# Altium schematic sheet 12-Dash_Inputs.SchDoc
size A4
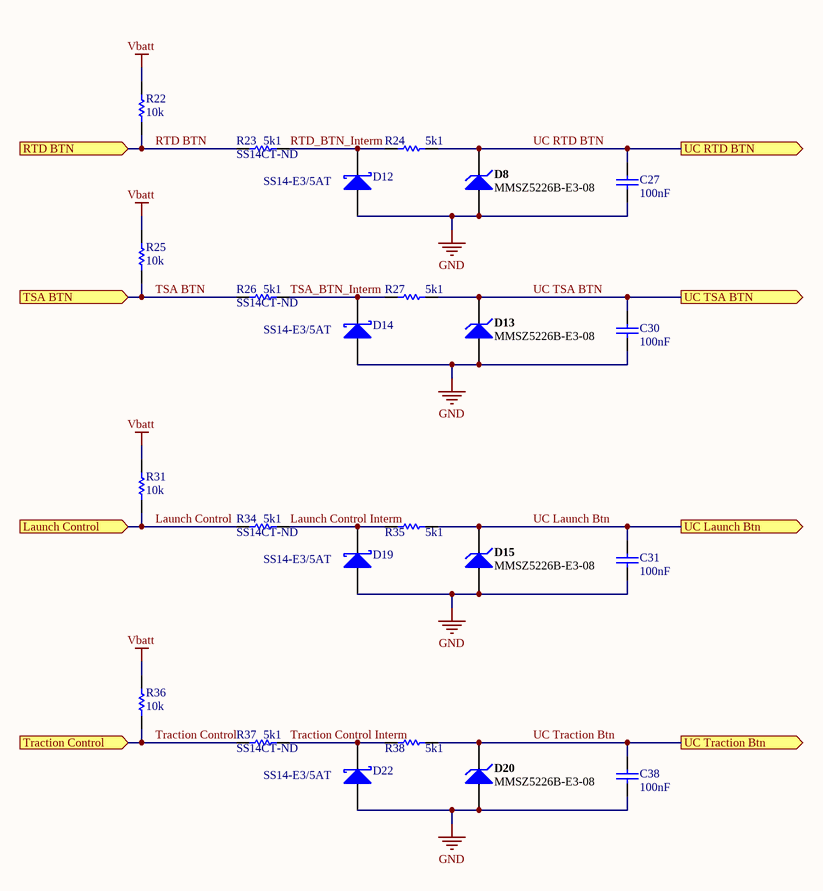
[diagram p0: 12-Dash_Inputs.SchDoc]

## Parts
C27  value 100nF  [1608[0603]]  (hidden comment: Cap)
C30  value 100nF  [1608[0603]]  (hidden comment: Cap)
C31  value 100nF  [1608[0603]]  (hidden comment: Cap)
C38  value 100nF  [1608[0603]]  (hidden comment: Cap)
D8  MMSZ5226B-E3-08  [VISH-SOD-123-2_V]
D12  SS14-E3/5AT  Supplier Part Number 1: SS14CT-ND  [VISH-DO-214AC-2_V]
D13  MMSZ5226B-E3-08  [VISH-SOD-123-2_V]
D14  SS14-E3/5AT  Supplier Part Number 1: SS14CT-ND  [VISH-DO-214AC-2_V]
D15  MMSZ5226B-E3-08  [VISH-SOD-123-2_V]
D19  SS14-E3/5AT  Supplier Part Number 1: SS14CT-ND  [VISH-DO-214AC-2_V]
D20  MMSZ5226B-E3-08  [VISH-SOD-123-2_V]
D22  SS14-E3/5AT  Supplier Part Number 1: SS14CT-ND  [VISH-DO-214AC-2_V]
R22  value 10k  [1608[0603]]  (hidden comment: Res1)
R23  value 5k1  [1608[0603]]  (hidden comment: Res1)
R24  value 5k1  [1608[0603]]  (hidden comment: Res1)
R25  value 10k  [1608[0603]]  (hidden comment: Res1)
R26  value 5k1  [1608[0603]]  (hidden comment: Res1)
R27  value 5k1  [1608[0603]]  (hidden comment: Res1)
R31  value 10k  [1608[0603]]  (hidden comment: Res1)
R34  value 5k1  [1608[0603]]  (hidden comment: Res1)
R35  value 5k1  [1608[0603]]  (hidden comment: Res1)
R36  value 10k  [1608[0603]]  (hidden comment: Res1)
R37  value 5k1  [1608[0603]]  (hidden comment: Res1)
R38  value 5k1  [1608[0603]]  (hidden comment: Res1)

## Ports
Launch Control (in), RTD BTN (in), Traction Control (in), TSA BTN (in), UC Launch Btn (out), UC RTD BTN (out), UC Traction Btn (out), UC TSA BTN (out)

## Nets
GND: C27.1 C30.1 C31.1 C38.1 D8.1(A) D12.1(A) D13.1(A) D14.1(A) D15.1(A) D19.1(A) D20.1(A) D22.1(A)
Vbatt: R22.2 R25.2 R31.2 R36.2
Launch Control: R31.1 R34.1 ; port Launch Control
Launch Control Interm: D19.2(K) R34.2 R35.1
RTD BTN: R22.1 R23.1 ; port RTD BTN
RTD_BTN_Interm: D12.2(K) R23.2 R24.1
Traction Control: R36.1 R37.1 ; port Traction Control
Traction Control Interm: D22.2(K) R37.2 R38.1
TSA BTN: R25.1 R26.1 ; port TSA BTN
TSA_BTN_Interm: D14.2(K) R26.2 R27.1
UC Launch Btn: C31.2 D15.2(K) R35.2 ; port UC Launch Btn
UC RTD BTN: C27.2 D8.2(K) R24.2 ; port UC RTD BTN
UC Traction Btn: C38.2 D20.2(K) R38.2 ; port UC Traction Btn
UC TSA BTN: C30.2 D13.2(K) R27.2 ; port UC TSA BTN

## Library data of the parts
C27 C30 C31 C38 = Cap: Capacitor; Manufacturer: Yageo; Manufacturer Part Number: CC0603KRX7R9BB104; Capacitance: 0.10µF; Tolerance: ±10%; Voltage - Rated: 50V; Temperature Coefficient: X7R; Supplier 1: Digi-Key; Supplier Part Number 1: 311-1344-1-ND; RoHS: RoHS Compliant; Category: Capacitors; Stock 1: 4016262; Pricing 1: 1=0.15, 10=0.043, 25=0.0312, 50=0.0232, 100=0.0189, 250=0.0158, 500=0.01346, 1000=0.01059 (CAD); Packaging: Cut Tape (CT); Part Status: Active; Operating Temperature: -55°C ~ 125°C; Features: -; Ratings: -; Applications: General Purpose; Failure Rate: -; Mounting Type: Surface Mount, MLCC; Package / Case: 0603 (1608 Metric); Size / Dimension: 0.063" L x 0.031" W (1.60mm x 0.80mm); Height - Seated (Max): -; Thickness (Max): 0.035" (0.90mm); Lead Spacing: -; Lead Style: -; ComponentLink1URL: http://www.yageo.com/documents/recent/UPY-GPHC_X7R_6.3V-to-50V_16.pdf; ComponentLink1Description: http://www.yageo.com/documents/recent/UPY-GPHC_X7R_6.3V-to-50V_16.pdf
D8 D13 D15 D20 = CMP-0931-00026-1: Small Signal Zener Diode, 3.3 V +/- 5%, -55 to 155 degC, 2-Pin SOD-123, RoHS, Tape and Reel; Manufacturer: Vishay Semiconductor; Manufacturer Part Number: MMSZ5226B-7-F; Tolerance: +/- 5%; Test Current (IZT1) (mA): 20; Power Dissipation (mW): 500; Int. Construction: Single; Zener Impedance (IZT1) (Max.) (Ohm): 28; Zener Voltage (NOM.) (V): 3.3; Voltage - Zener (Nom) (Vz): 3.3V; Power - Max: 500mW; Impedance (Max) (Zzt): 28 Ohm; Current - Reverse Leakage @ Vr: 25µA @ 1V; Voltage - Forward (Vf) (Max) @ If: 900mV @ 10mA; DatasheetVersion: Rev. 1.9; ComponentLink2Description: Datasheet; PackageReference: SOD-123-2; ComponentLink1URL: http://www.vishay.com/; ComponentLink1Description: Manufacturer URL; Mounting Technology: Surface Mount; ComponentLink3Description: Package Specification; ComponentLink3URL: http://www.vishay.com/docs/85774/mmsz5225.pdf; PartNumber: MMSZ5226B-E3-08; PackageDescription: 2-Pin SMD, Body 2.7 x 1.55 mm, Height 1.35 mm; Operating Temperature: -55 to 150 degC; Packing: Tape and Reel; PackageVersion: Rev. 1.9; ComponentLink2URL: http://www.vishay.com/docs/85774/mmsz5225.pdf; RoHS: TRUE; Supplier 1: Digi-Key; Supplier Part Number 1: MMSZ5226B-FDICT-ND; Category: Discrete Semiconductor Products; Stock 1: 45935; Pricing 1: 1=0.29, 10=0.263, 100=0.1426, 500=0.08778, 1000=0.05985 (CAD); Packaging: Cut Tape (CT); Part Status: Active; Mounting Type: Surface Mount; Package / Case: SOD-123; Supplier Device Package: SOD-123; ComponentLink4URL: http://www.diodes.com/_files/datasheets/ds18010.pdf; ComponentLink4Description: http://www.diodes.com/_files/datasheets/ds18010.pdf
D12 D14 D19 D22 = CMP-0549-00004-1: Schottky Barrier Rectifier, 40 V Maximum DC Blocking Voltage, -65 to 125 degC, 2-Pin SMA Case, RoHS; Manufacturer: Vishay Semiconductor; IFSM: 40 A; IF(AV): 1 A Max.; VRRM: 40 V Max.; VRMS: 28 V Max.; PackageReference: DO-214AC-2; RoHS: TRUE; DatasheetVersion: 12/17/2012; ComponentLink1Description: Manufacturer URL; ComponentLink2URL: http://www.vishay.com/docs/88746/ss12.pdf; PartNumber: SS14-E3/5AT; PackageVersion: Dec-12; Operating Temperature: -65 to 125 degC; ComponentLink3URL: http://www.vishay.com/docs/88746/ss12.pdf; PackageDescription: 2-Pin SMD, Body 4.245 x 2.665 mm, Height 2.29 mm; ComponentLink1URL: http://www.vishay.com/; ComponentLink3Description: Package Specification; ComponentLink2Description: Datasheet; Mounting Technology: Surface Mount; VDC: 40 V Max.; Supplier 1: Digi-Key
R22 R25 R31 R36 = Res1: Resistor; Manufacturer: Yageo; Manufacturer Part Number: RC0603JR-0710KL; Tolerance: ±5%; Power (Watts): 0.1W, 1/10W; Temperature Coefficient: ±100ppm/°C; Supplier 1: Digi-Key; Supplier Part Number 1: 311-10KGRCT-ND; RoHS: RoHS Compliant; Category: Resistors; Stock 1: 2936292; Pricing 1: 1=0.16, 10=0.016, 25=0.0112, 50=0.0084, 100=0.0062, 250=0.0048, 500=0.00382, 1000=0.00281 (CAD); Packaging: Cut Tape (CT); Part Status: Active; Resistance (Ohms): 10k; Composition: Thick Film; Features: Moisture Resistant; Operating Temperature: -55°C ~ 155°C; Package / Case: 0603 (1608 Metric); Supplier Device Package: 0603; Size / Dimension: 0.063" L x 0.031" W (1.60mm x 0.80mm); Height - Seated (Max): 0.022" (0.55mm); Number of Terminations: 2; Failure Rate: -; ComponentLink1URL: http://www.yageo.com/NewPortal/yageodocoutput?fileName=/pdf/R-Chip/PYu-RC_Group_51_RoHS_L_4.pdf; ComponentLink1Description: http://www.yageo.com/NewPortal/yageodocoutput?fileName=/pdf/R-Chip/PYu-RC_Group_51_RoHS_L_4.pdf
R23 R24 R26 R27 R34 R35 R37 R38 = Res1: Resistor; Manufacturer: Yageo; Manufacturer Part Number: RC0603JR-075K1L; Resistance (Ohms): 5.1k; Tolerance: ±5%; Power (Watts): 0.1W, 1/10W; Temperature Coefficient: ±100ppm/°C; Supplier 1: Digi-Key; Supplier Part Number 1: 311-5.1KGRCT-ND; RoHS: RoHS Compliant; Category: Resistors; Stock 1: 782184; Pricing 1: 1=0.16, 10=0.016, 25=0.0112, 50=0.0084, 100=0.0062, 250=0.0048, 500=0.00382, 1000=0.00281 (CAD); Packaging: Cut Tape (CT); Part Status: Active; Composition: Thick Film; Features: Moisture Resistant; Operating Temperature: -55°C ~ 155°C; Package / Case: 0603 (1608 Metric); Supplier Device Package: 0603; Size / Dimension: 0.063" L x 0.031" W (1.60mm x 0.80mm); Height - Seated (Max): 0.022" (0.55mm); Number of Terminations: 2; Failure Rate: -; ComponentLink1URL: http://www.yageo.com/NewPortal/yageodocoutput?fileName=/pdf/R-Chip/PYu-RC_Group_51_RoHS_L_4.pdf; ComponentLink1Description: http://www.yageo.com/NewPortal/yageodocoutput?fileName=/pdf/R-Chip/PYu-RC_Group_51_RoHS_L_4.pdf